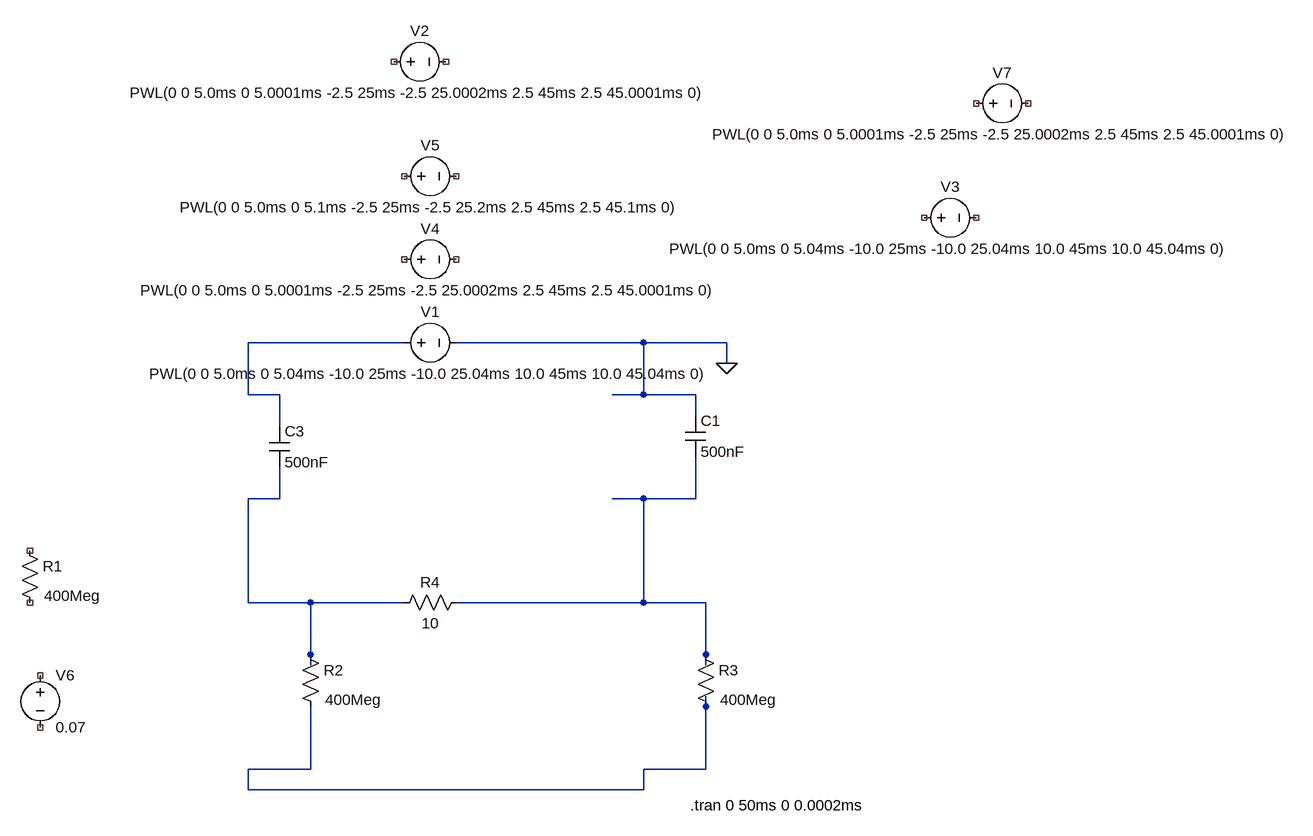
[diagram p0: schematic 電圧刺激等価回路_論文用_簡略化20210122.asc]
電圧刺激等価回路_論文用_簡略化20210122.asc, the LTspice schematic file:
Version 4
SHEET 1 1992 680
WIRE 368 -368 128 -368
WIRE 736 -368 448 -368
WIRE 864 -368 736 -368
WIRE 864 -336 864 -368
WIRE 128 -288 128 -368
WIRE 176 -288 128 -288
WIRE 736 -288 736 -368
WIRE 736 -288 688 -288
WIRE 816 -288 736 -288
WIRE 816 -256 816 -288
WIRE 176 -240 176 -288
WIRE 176 -128 176 -176
WIRE 176 -128 128 -128
WIRE 736 -128 688 -128
WIRE 816 -128 816 -192
WIRE 816 -128 736 -128
WIRE 128 32 128 -128
WIRE 224 32 128 32
WIRE 368 32 224 32
WIRE 736 32 736 -128
WIRE 736 32 448 32
WIRE 832 32 736 32
WIRE 224 112 224 32
WIRE 832 112 832 32
WIRE 224 128 224 112
WIRE 832 128 832 112
WIRE 832 192 832 176
WIRE 224 288 224 192
WIRE 224 288 128 288
WIRE 832 288 832 192
WIRE 832 288 736 288
WIRE 128 320 128 288
WIRE 736 320 736 288
WIRE 736 320 128 320
FLAG 864 -336 0
SYMBOL cap 160 -240 R0
SYMATTR InstName C3
SYMATTR Value 500nF
SYMBOL res 464 16 R90
WINDOW 0 0 56 VBottom 2
WINDOW 3 32 56 VTop 2
SYMATTR InstName R4
SYMATTR Value 10
SYMBOL voltage 352 -624 R270
WINDOW 0 32 56 VTop 2
WINDOW 3 -32 56 VBottom 2
WINDOW 123 0 0 Left 0
WINDOW 39 0 0 Left 0
SYMATTR InstName V5
SYMATTR Value PWL(0 0 5.0ms 0 5.1ms -2.5 25ms -2.5 25.2ms 2.5 45ms 2.5 45.1ms 0)
SYMBOL voltage 352 -496 R270
WINDOW 0 32 56 VTop 2
WINDOW 3 -32 56 VBottom 2
WINDOW 123 0 0 Left 0
WINDOW 39 0 0 Left 0
SYMATTR InstName V4
SYMATTR Value PWL(0 0 5.0ms 0 5.0001ms -2.5 25ms -2.5 25.0002ms 2.5 45ms 2.5 45.0001ms 0)
SYMBOL voltage -192 128 R0
WINDOW 123 0 0 Left 0
WINDOW 39 0 0 Left 0
SYMATTR InstName V6
SYMATTR Value 0.07
SYMBOL res -224 -64 R0
WINDOW 3 38 85 Left 2
SYMATTR Value 400Meg
SYMATTR InstName R1
SYMBOL voltage 336 -800 R270
WINDOW 0 32 56 VTop 2
WINDOW 3 -32 56 VBottom 2
WINDOW 123 0 0 Left 0
WINDOW 39 0 0 Left 0
SYMATTR InstName V2
SYMATTR Value PWL(0 0 5.0ms 0 5.0001ms -2.5 25ms -2.5 25.0002ms 2.5 45ms 2.5 45.0001ms 0)
SYMBOL cap 800 -256 R0
SYMATTR InstName C1
SYMATTR Value 500nF
SYMBOL voltage 1152 -560 R270
WINDOW 0 32 56 VTop 2
WINDOW 3 -32 56 VBottom 2
WINDOW 123 0 0 Left 0
WINDOW 39 0 0 Left 0
SYMATTR InstName V3
SYMATTR Value PWL(0 0 5.0ms 0 5.04ms -10.0 25ms -10.0 25.04ms 10.0 45ms 10.0 45.04ms 0)
SYMBOL voltage 1232 -736 R270
WINDOW 0 32 56 VTop 2
WINDOW 3 -32 56 VBottom 2
WINDOW 123 0 0 Left 0
WINDOW 39 0 0 Left 0
SYMATTR InstName V7
SYMATTR Value PWL(0 0 5.0ms 0 5.0001ms -2.5 25ms -2.5 25.0002ms 2.5 45ms 2.5 45.0001ms 0)
SYMBOL voltage 352 -368 R270
WINDOW 0 32 56 VTop 2
WINDOW 3 -32 56 VBottom 2
WINDOW 123 0 0 Left 0
WINDOW 39 0 0 Left 0
SYMATTR InstName V1
SYMATTR Value PWL(0 0 5.0ms 0 5.04ms -10.0 25ms -10.0 25.04ms 10.0 45ms 10.0 45.04ms 0)
SYMBOL res 208 96 R0
WINDOW 3 38 85 Left 2
SYMATTR Value 400Meg
SYMATTR InstName R2
SYMBOL res 816 96 R0
WINDOW 3 38 85 Left 2
SYMATTR Value 400Meg
SYMATTR InstName R3
TEXT 808 344 Left 2 !.tran 0 50ms 0 0.0002ms

The netlist it stands for:
* 電圧刺激等価回路_論文用_簡略化20210122.asc
C3 N001 N002 500nF
R4 N003 N002 10
V5 NC_01 NC_02 PWL(0 0 5.0ms 0 5.1ms -2.5 25ms -2.5 25.2ms 2.5 45ms 2.5 45.1ms 0)
V4 NC_03 NC_04 PWL(0 0 5.0ms 0 5.0001ms -2.5 25ms -2.5 25.0002ms 2.5 45ms 2.5 45.0001ms 0)
V6 NC_05 NC_06 0.07
R1 NC_07 NC_08 400Meg
V2 NC_09 NC_10 PWL(0 0 5.0ms 0 5.0001ms -2.5 25ms -2.5 25.0002ms 2.5 45ms 2.5 45.0001ms 0)
C1 0 N003 500nF
V3 NC_11 NC_12 PWL(0 0 5.0ms 0 5.04ms -10.0 25ms -10.0 25.04ms 10.0 45ms 10.0 45.04ms 0)
V7 NC_13 NC_14 PWL(0 0 5.0ms 0 5.0001ms -2.5 25ms -2.5 25.0002ms 2.5 45ms 2.5 45.0001ms 0)
V1 N001 0 PWL(0 0 5.0ms 0 5.04ms -10.0 25ms -10.0 25.04ms 10.0 45ms 10.0 45.04ms 0)
R2 N002 N004 400Meg
R3 N003 N004 400Meg
.tran 0 50ms 0 0.0002ms
.backanno
.end